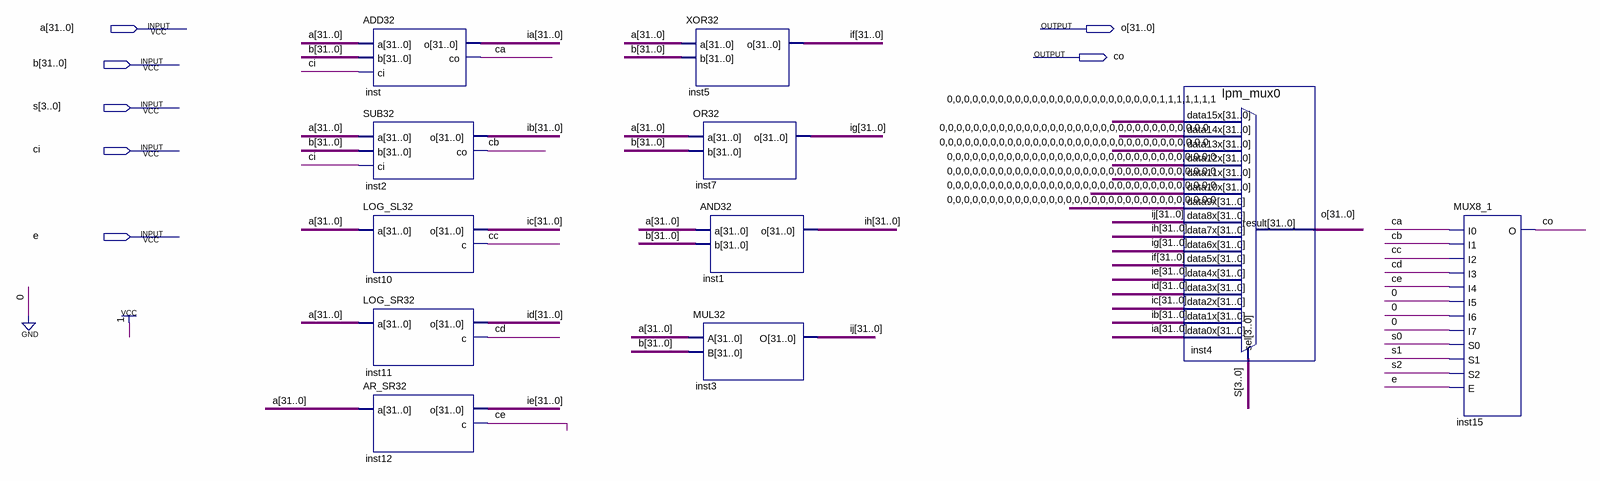
[diagram p0: schematic sheet]
// Quartus schematic ALU.bdf as structural Verilog: 11 symbols, 7 pins
module ALU (
  input  [31:0] a,
  input  [31:0] b,
  input  [3:0] s,
  input  ci,
  input  e,
  output [31:0] o,
  output co
);

  wire ca, cb, cc, cd, ce;
  wire [31:0] ia, ib, ic, id, ie, \if , ig, ih, ij;

  ADD32 inst (.a(a), .b(b), .ci(ci), .o(ia), .co(ca));
  SUB32 inst2 (.a(a), .b(b), .ci(ci), .o(ib), .co(cb));
  LOG_SL32 inst10 (.a(a), .o(ic), .c(cc));
  LOG_SR32 inst11 (.a(a), .o(id), .c(cd));
  AR_SR32 inst12 (.a(a), .o(ie), .c(ce));
  XOR32 inst5 (.a(a), .b(b), .o(\if ));
  OR32 inst7 (.a(a), .b(b), .o(ig));
  AND32 inst1 (.a(a), .b(b), .o(ih));
  MUL32 inst3 (.A(a), .B(b), .O(ij));
  lpm_mux0 inst4 (
    .data15x(32'b00000000000000000000000001111111), .data14x({32{1'b0}}), .data13x({32{1'b0}}),
    .data12x({32{1'b0}}), .data11x({32{1'b0}}), .data10x({32{1'b0}}), .data9x({32{1'b0}}), .data8x(ij),
    .data7x(ih), .data6x(ig), .data5x(\if ), .data4x(ie), .data3x(id), .data2x(ic), .data1x(ib), .data0x(ia),
    .sel(s), .result(o));
  MUX8_1 inst15 (
    .I0(ca), .I1(cb), .I2(cc), .I3(cd), .I4(ce), .I5(1'b0), .I6(1'b0), .I7(1'b0), .S0(s[0]), .S1(s[1]),
    .S2(s[2]), .E(e), .O(co));
endmodule
